# EAGLE schematic shematic (EAGLE 6.4)
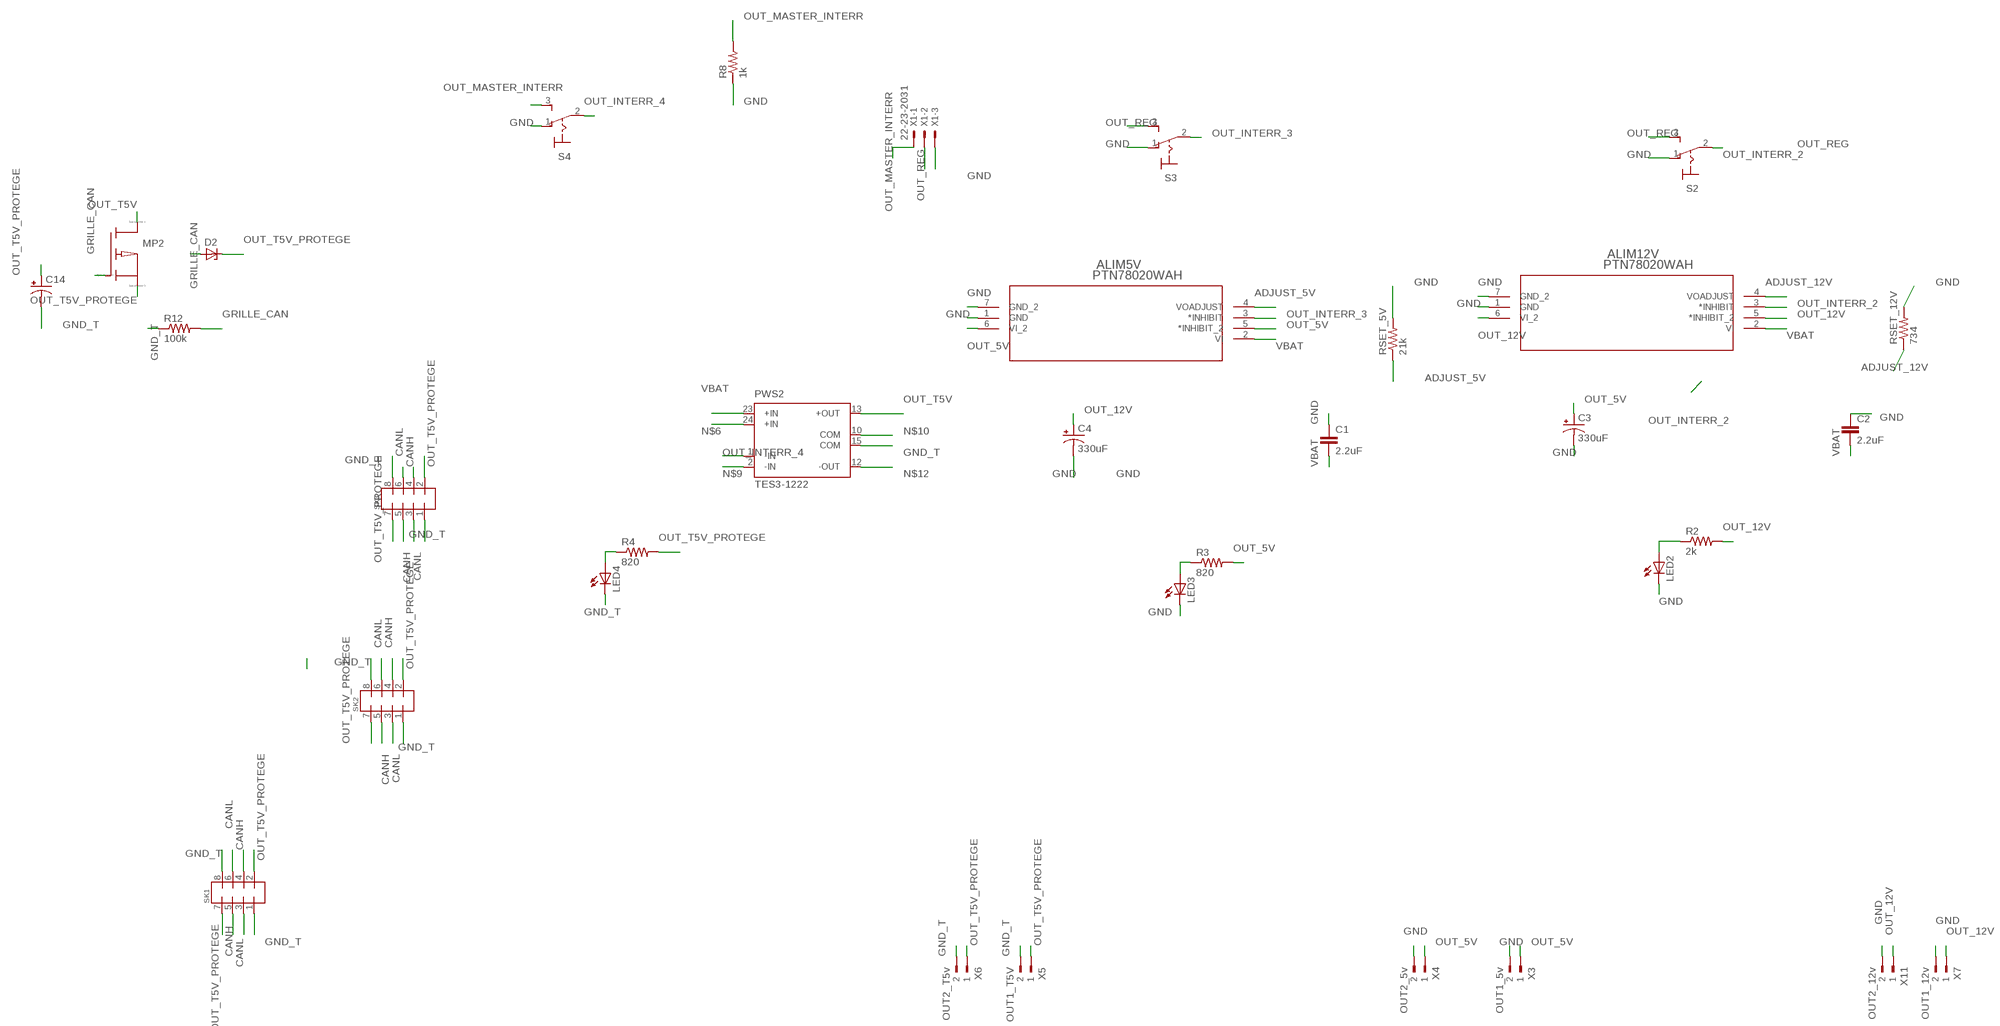
[diagram p0: schematic, sheet 1, part 1 of 2]
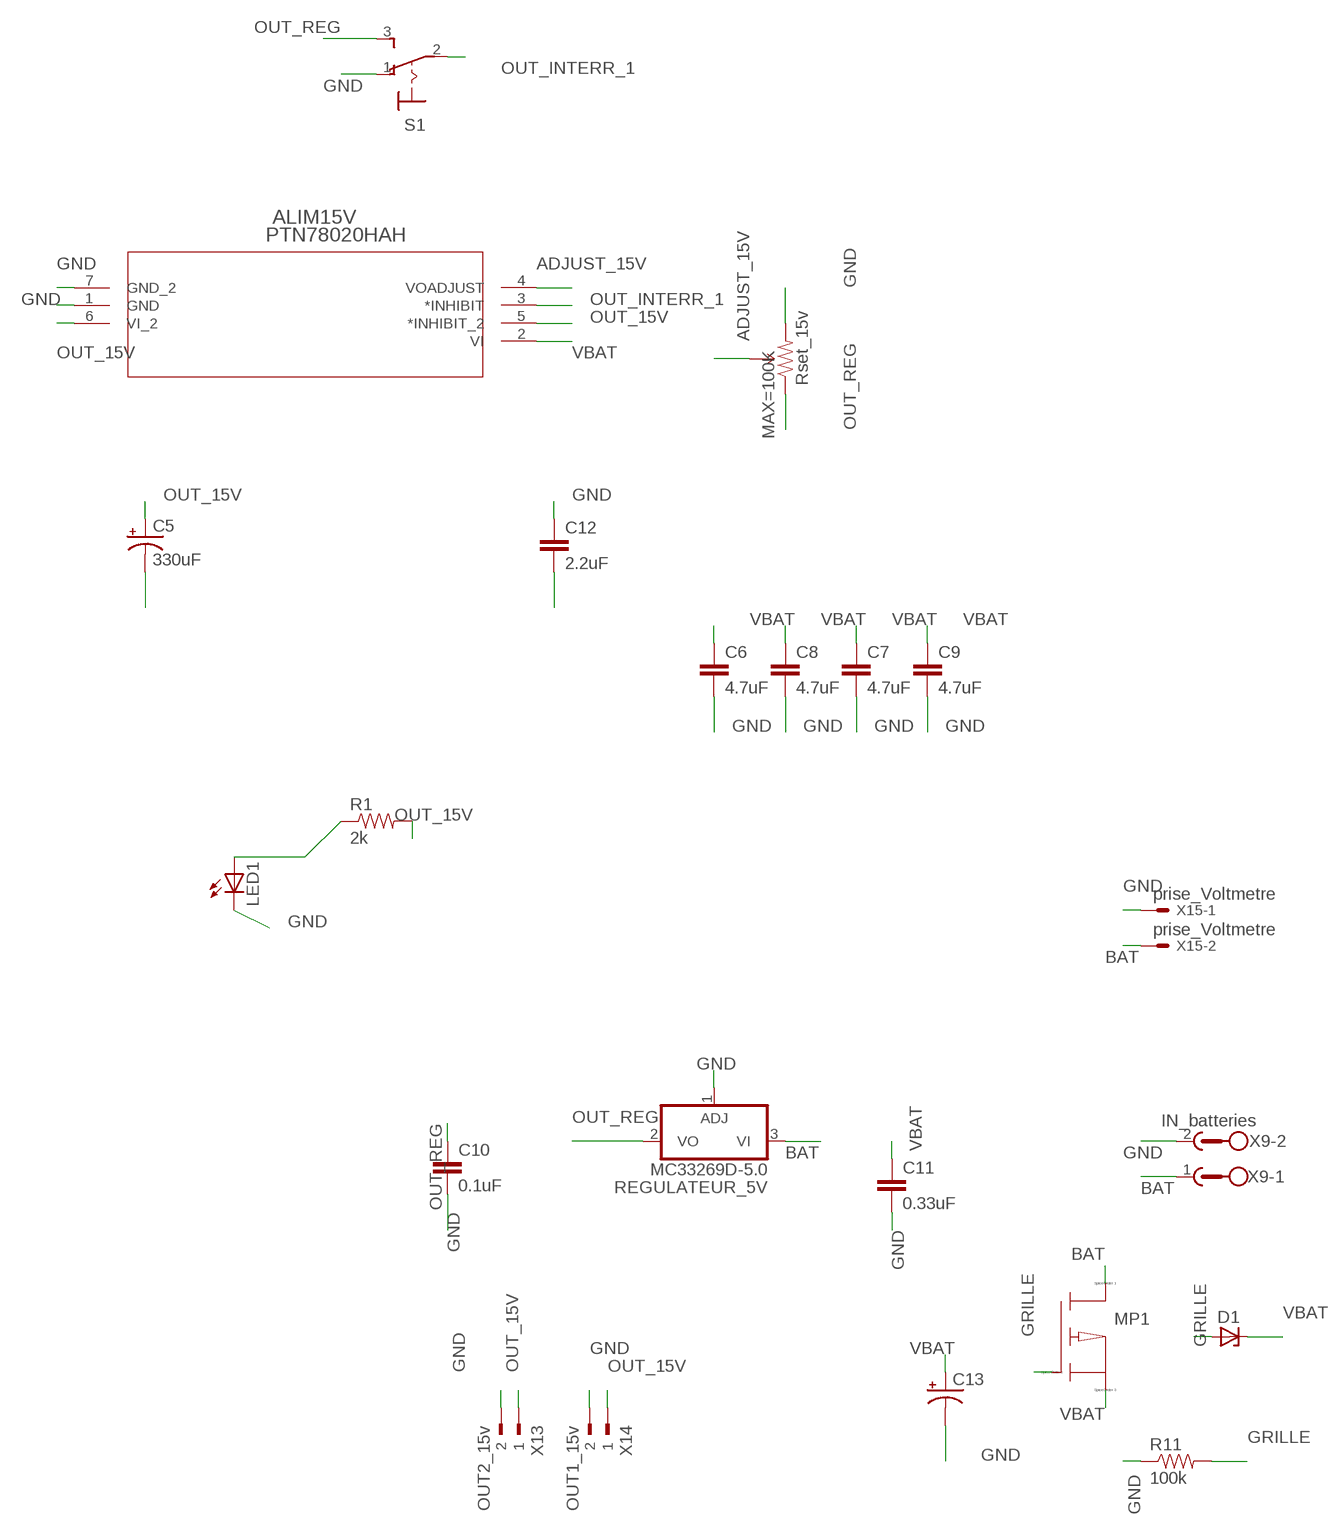
[diagram p1: schematic, sheet 1, part 2 of 2]

## Parts
ALIM5V  PTN78020WAH  PTN78020_  [EUK7]
ALIM12V  PTN78020WAH  PTN78020_  [EUK7]
ALIM15V  PTN78020HAH  PTN78020_  [EUK7]
C1  2.2uF  CAP0805  [0805]
C2  2.2uF  CAP0805  [0805]
C3  330uF  CAP_POLPTH1  [CPOL-RADIAL-100UF-25V]
C4  330uF  CAP_POLPTH1  [CPOL-RADIAL-100UF-25V]
C5  330uF  CAP_POLPTH1  [CPOL-RADIAL-100UF-25V]
C6  4.7uF  CAP0805  [0805]
C7  4.7uF  CAP0805  [0805]
C8  4.7uF  CAP0805  [0805]
C9  4.7uF  CAP0805  [0805]
C10  0.1uF  CAP0805  [0805]
C11  0.33uF  CAP0805  [0805]
C12  2.2uF  CAP0805  [0805]
C13  CAP_POLPTH1  [CPOL-RADIAL-100UF-25V]
C14  CAP_POLPTH1  [CPOL-RADIAL-100UF-25V]
D1  ZENER-DIODESOT23  [SOT23]
D2  ZENER-DIODESOT23  [SOT23]
LED1  LEDCHIP-LED0805  [CHIP-LED0805]
LED2  LEDCHIP-LED0805  [CHIP-LED0805]
LED3  LEDCHIP-LED0805  [CHIP-LED0805]
LED4  LEDCHIP-LED0805  [CHIP-LED0805]
MAX=100K  Rset_15v  TRIMPOT-PTH-KNOB  [3386U]
MP1  PMOS  [SOT23]
MP2  PMOS  [SOT23]
PWS2  TES3-1222  [TES3]
R1  2k  RESISTOR0805-RES  [0805]
R2  2k  RESISTOR0805-RES  [0805]
R3  820  RESISTOR0805-RES  [0805]
R4  820  RESISTOR0805-RES  [0805]
R8  1k  RESISTOR0805-RES  [0805]
R11  100k  RESISTOR0805-RES  [0805]
R12  100k  RESISTOR0805-RES  [0805]
REGULATEUR_5V  MC33269D-5.0  [DPACK]
RSET_5V  21k  RESISTOR0805-RES  [0805]
RSET_12V  734  RESISTOR0805-RES  [0805]
S1  M9040P  [M9040P]
S2  M9040P  [M9040P]
S3  M9040P  [M9040P]
S4  M9040P  [M9040P]
SK1  MMATCH-8-PTH  [AMP-215079-8]
SK2  MMATCH-8-PTH  [AMP-215079-8]
SK3  MMATCH-8-PTH  [AMP-215079-8]
X1  22-23-2031  [22-23-2031]
X3  OUT1_5v  90-2  [90-2]
X4  OUT2_5v  90-2  [90-2]
X5  OUT1_T5V  90-2  [90-2]
X6  OUT2_T5v  90-2  [90-2]
X7  OUT1_12v  90-2  [90-2]
X9  IN_batteries  GMSTBA2  [GMSTBA2]
X11  OUT2_12v  90-2  [90-2]
X13  OUT2_15v  90-2  [90-2]
X14  OUT1_15v  90-2  [90-2]
X15  prise_Voltmetre  KK-156-2  [KK-156-2]

## Nets
ADJUST_5V: ALIM5V.4(VOADJUST) RSET_5V.1
ADJUST_12V: ALIM12V.4(VOADJUST) RSET_12V.1
ADJUST_15V: ALIM15V.4(VOADJUST) MAX=100K.2(WIPER)
BAT: MP1.3(D) REGULATEUR_5V.3(VI) X9.1 X15.2
CANH: SK1.4 SK1.5 SK2.4 SK2.5 SK3.4 SK3.5
CANL: SK1.3 SK1.6 SK2.3 SK2.6 SK3.3 SK3.6
GND: ALIM5V.1(GND) ALIM5V.7(GND_2) ALIM12V.1(GND) ALIM12V.7(GND_2) ALIM15V.1(GND) ALIM15V.7(GND_2) C1.1 C2.1 C3.2(-) C4.2(-) C5.2(-) C6.2 C7.2 C8.2 C9.2 C10.2 C11.2 C12.1 C13.2(-) LED1.C LED2.C LED3.C MAX=100K.3(CW) R8.1 R11.1 REGULATEUR_5V.1(ADJ) RSET_5V.2 RSET_12V.2 S1.1(O) S2.1(O) S3.1(O) S4.1(O) X1.3 X3.2 X4.2 X7.2 X9.2 X11.2 X13.2 X14.2 X15.1
GND_T: C14.2(-) LED4.C PWS2.15(COM) R12.1 SK1.1 SK1.8 SK2.1 SK2.8 SK3.1 SK3.8 X5.2 X6.2
GRILLE: D1.1(A) MP1.1(G) R11.2
GRILLE_CAN: D2.1(A) MP2.1(G) R12.2
N$2: LED1.A R1.1
N$3: LED2.A R2.1
N$4: LED3.A R3.1
N$5: LED4.A R4.1
N$6: PWS2.24(+IN)
N$9: PWS2.2(-IN)
N$10: PWS2.10(COM)
N$12: PWS2.12(-OUT)
OUT_5V: ALIM5V.5(*INHIBIT_2) ALIM5V.6(VI_2) C3.1(+) R3.2 X3.1 X4.1
OUT_12V: ALIM12V.5(*INHIBIT_2) ALIM12V.6(VI_2) C4.1(+) R2.2 X7.1 X11.1
OUT_15V: ALIM15V.5(*INHIBIT_2) ALIM15V.6(VI_2) C5.1(+) R1.2 X13.1 X14.1
OUT_INTERR_1: ALIM15V.3(*INHIBIT) S1.2(P)
OUT_INTERR_2: ALIM12V.3(*INHIBIT) S2.2(P)
OUT_INTERR_3: ALIM5V.3(*INHIBIT) S3.2(P)
OUT_INTERR_4: PWS2.1(-IN) S4.2(P)
OUT_MASTER_INTERR: R8.2 S4.3(S) X1.1
OUT_REG: C10.1 MAX=100K.1(CCW) REGULATEUR_5V.2(VO) S1.3(S) S2.3(S) S3.3(S) X1.2
OUT_T5V: MP2.3(D) PWS2.13(+OUT)
OUT_T5V_PROTEGE: C14.1(+) D2.3(C) MP2.2(S) R4.2 SK1.2 SK1.7 SK2.2 SK2.7 SK3.2 SK3.7 X5.1 X6.1
VBAT: ALIM5V.2(VI) ALIM12V.2(VI) ALIM15V.2(VI) C1.2 C2.2 C6.1 C7.1 C8.1 C9.1 C11.1 C12.2 C13.1(+) D1.3(C) MP1.2(S) PWS2.23(+IN)

## Library data of the parts
ALIM5V ALIM12V ALIM15V = ptn78020_:PTN78020_
C1 C2 C6-C12 = SparkFun-Passives:CAP: Capacitor Standard 0603 ceramic capacitor, and 0.1" leaded capacitor.
C3-C5 = SparkFun-Capacitors:CAP_POL: Capacitor Polarized These are standard SMD and PTH capacitors. Normally 10uF, 47uF, and 100uF in electrolytic and tantalum varieties. Always verify the external diameter of the through hole cap, it varies with capacity, voltage, and manufacturer. The EIA devices should be standard.
C13 C14 = SparkFun-Passives:CAP_POL: Capacitor Polarized These are standard SMD and PTH capacitors. Normally 10uF, 47uF, and 100uF in electrolytic and tantalum varieties. Always verify the external diameter of the through hole cap, it varies with capacity, voltage, and manufacturer. The EIA devices should be standard.
D1 D2 = diode:ZENER-DIODE: Z-Diode
LED1-LED4 = adafruit:LED: LED OSRAM: - CHIPLED LG R971, LG N971, LY N971, LG Q971, LY Q971, LO R971, LY R971 LH N974, LH R974 LS Q976, LO Q976, LY Q976 LO Q996 - Hyper CHIPLED LW Q18S LB Q993, LB Q99A, LB R99A - SideLED LS A670, LO A670, LY A670, LG A670, LP A670 LB A673, LV A673, LT A673, LW A673 LH A674 LY A675 LS A676, LA A676, LO A676, LY A676, LW A676 LS A679, LY A679, LG A679 - Hyper Micro SIDELED® LS Y876, LA Y876, LO Y876, LY Y876 LT Y87S - SmartLED LW L88C, LW L88S LB L89C, LB L89S, LG L890 LS L89K, LO L89K, LY L89K LS L896, LA L896, LO L896, LY L896 - TOPLED LS T670, LO T670, LY T670, LG T670, LP T670 LSG T670, LSP T670, LSY T670, LOP T670, LYG T670 LG T671, LOG T671, LSG T671 LB T673, LV T673, LT T673, LW T673 LH T674 LS T676, LA T676, LO T676, LY T676, LB T676, LH T676, LSB T676, LW T676 LB T67C, LV T67C, LT T67C, LS T67K, LO T67K, LY T67K, LW E67C LS E67B, LA E67B, LO E67B, LY E67B, LB E67C, LV E67C, LT E67C LW T67C LS T679, LY T679, LG T679 LS T770, LO T770, LY T770, LG T770, LP T770 LB T773, LV T773, LT T773, LW T773 LH T774 LS E675, LA E675, LY E675, LS T675 LS T776, LA T776, LO T776, LY T776, LB T776 LHGB T686 LT T68C, LB T68C - Hyper Mini TOPLED® LB M676 - Mini TOPLED Santana® LG M470 LS M47K, LO M47K, LY M47K Source: http://www.osram.convergy.de/
MAX=100K = SparkFun-Electromechanical:TRIMPOT: Various small potentiometers for "set-and-forget" applications
MP1 MP2 = sym:PMOS: P-Channel MOSFET transistor
PWS2 = traco-electronic:TES3-: DC/DC Converter Dual Output, 3W Source: Data sheet <http://www.tracopower.com/datasheet_g/tes3-d.pdf>
R1-R4 R8 = SparkFun-Resistors:RESISTOR: Resistor Basic schematic elements and footprints for 0603, 1206, and PTH resistors.
R11 R12 RSET_5V RSET_12V = SparkFun-Passives:RESISTOR: Resistor Basic schematic elements and footprints for 0603, 1206, and PTH resistors.
REGULATEUR_5V = linear:MC33269?*: Adjustable Output Low Dropout Voltage Regulator 800 mA Source: http://www.onsemi.com/pub/Collateral/MC33269-D.PDF
S1-S4 = switch:M9040P: TOGGLE SWITCH Marquardt
SK1-SK3 = jt-con-micromatch:MMATCH-8-*: AMP Micromatch 8-pin
X1 = con-molex:22-23-2031: .100" (2.54mm) Center Header - 3 Pin; MF: MOLEX; MPN: 22-23-2031; OC_FARNELL: 1462950; OC_NEWARK: 30C0862
X3-X7 X11 X13 X14 = con-weidmueller-sl35:90-2: WEIDMUELLER CLAMP CONNECTOR; OC_FARNELL: unknown; OC_NEWARK: unknown
X9 = con-phoenix-762:GMSTBA2: PHOENIX; MF: FARNELL; MPN: 1757242; OC_FARNELL: 3705171; OC_NEWARK: 71C4161
X15 = con-molex:KK-156-2: KK 156 HEADER Source: http://www.molex.com/pdm_docs/sd/026604100_sd.pdf; OC_FARNELL: unknown; OC_NEWARK: unknown

## Net classes
0 default: width 1.016 mm, drill 0.6 mm, clearance 0.3 mm
1 puissance: width 2.86 mm, drill 0.6 mm, clearance 2.86 mm to class 0, clearance 0.073 mm